# Altium schematic sheet SPI_Devices.SchDoc
size A4; SheetNumber: 7; SheetTotal: 11
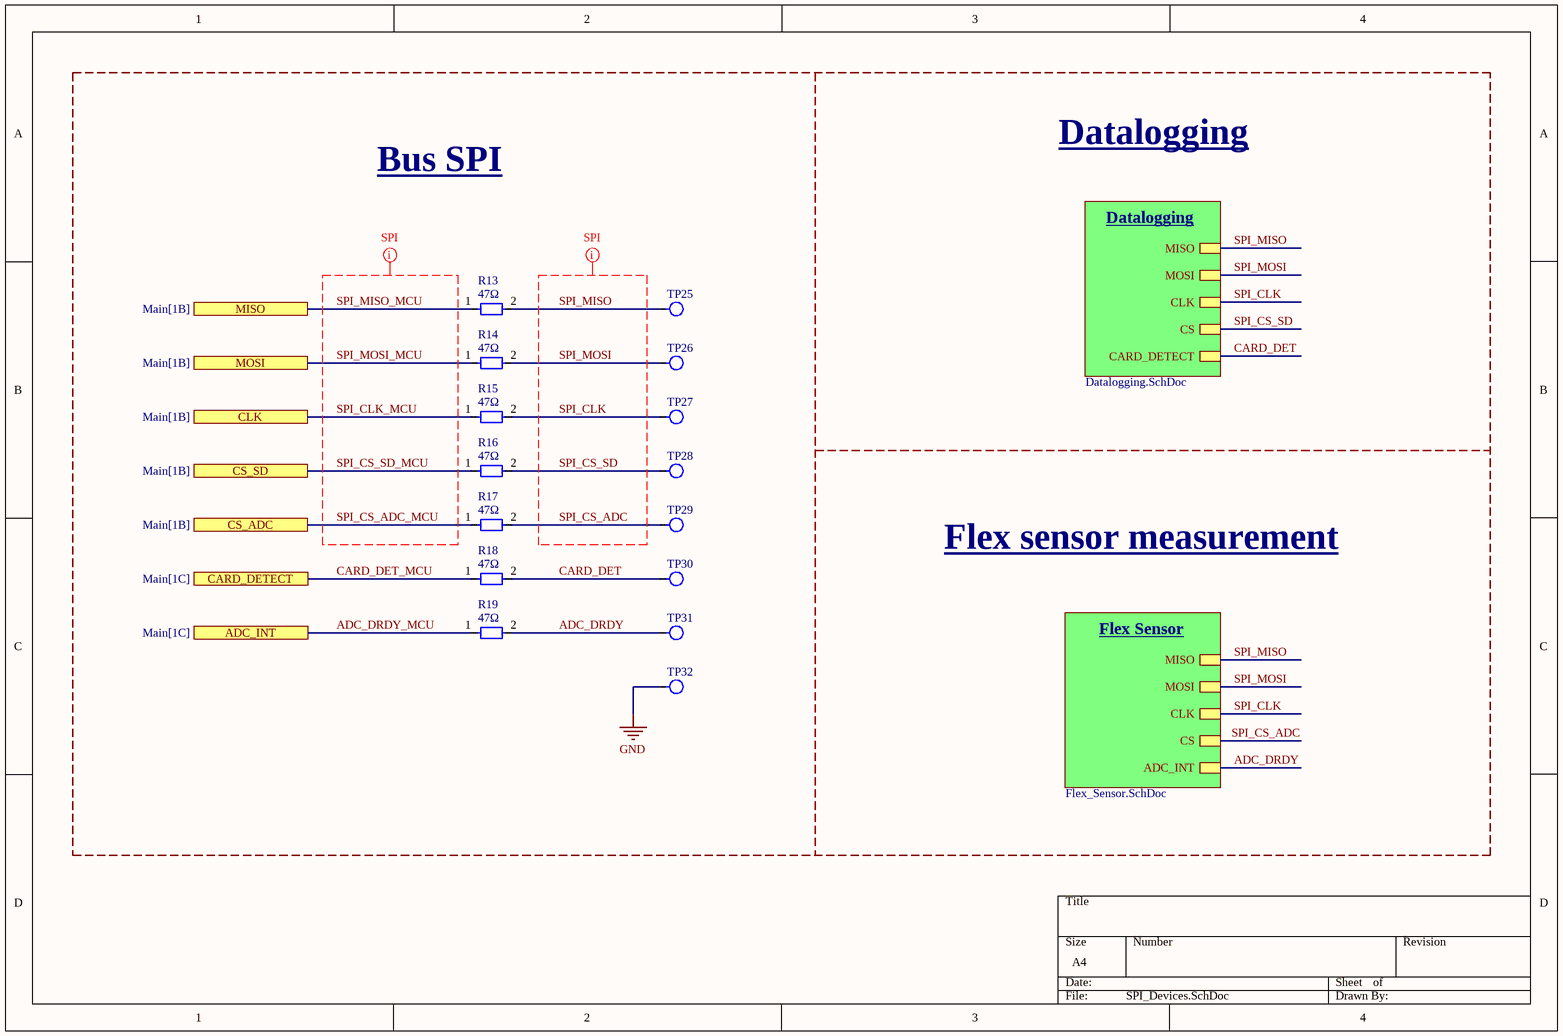
[diagram p0: SPI_Devices.SchDoc]

## Parts
R13  value 47Ω  [RES_0603]  (hidden comment: 47R)
R14  value 47Ω  [RES_0603]  (hidden comment: 47R)
R15  value 47Ω  [RES_0603]  (hidden comment: 47R)
R16  value 47Ω  [RES_0603]  (hidden comment: 47R)
R17  value 47Ω  [RES_0603]  (hidden comment: 47R)
R18  value 47Ω  [RES_0603]  (hidden comment: 47R)
R19  value 47Ω  [RES_0603]  (hidden comment: 47R)
TP25  Testpoint SMD  [Testpoint_SMD]  (value not drawn)  (no BOM)
TP26  Testpoint SMD  [Testpoint_SMD]  (value not drawn)  (no BOM)
TP27  Testpoint SMD  [Testpoint_SMD]  (value not drawn)  (no BOM)
TP28  Testpoint SMD  [Testpoint_SMD]  (value not drawn)  (no BOM)
TP29  Testpoint SMD  [Testpoint_SMD]  (value not drawn)  (no BOM)
TP30  Testpoint SMD  [Testpoint_SMD]  (value not drawn)  (no BOM)
TP31  Testpoint SMD  [Testpoint_SMD]  (value not drawn)  (no BOM)
TP32  Testpoint SMD  [Testpoint_SMD]  (value not drawn)  (no BOM)

## Sub-sheets
Datalogging = Datalogging.SchDoc: MISO, MOSI, CLK, CS, CARD_DETECT  | Titulo: Datalogging
Flex_Sensor = Flex_Sensor.SchDoc: MISO, MOSI, CLK, CS, ADC_INT  | Titulo: Flex Sensor

## Ports
ADC_INT (see Main[1C]), CARD_DETECT (see Main[1C]), CLK (see Main[1B]), CS_ADC (see Main[1B]), CS_SD (see Main[1B]), MISO (see Main[1B]), MOSI (see Main[1B])

## Nets
GND: TP32.1
ADC_DRDY: R19.2 TP31.1 ; sheet Flex_Sensor/ADC_INT
ADC_DRDY_MCU: R19.1 ; port ADC_INT
CARD_DET: R18.2 TP30.1 ; sheet Datalogging/CARD_DETECT
CARD_DET_MCU: R18.1 ; port CARD_DETECT
SPI_CLK: R15.2 TP27.1 ; sheet Datalogging/CLK, sheet Flex_Sensor/CLK
SPI_CLK_MCU: R15.1 ; port CLK
SPI_CS_ADC: R17.2 TP29.1 ; sheet Flex_Sensor/CS
SPI_CS_ADC_MCU: R17.1 ; port CS_ADC
SPI_CS_SD: R16.2 TP28.1 ; sheet Datalogging/CS
SPI_CS_SD_MCU: R16.1 ; port CS_SD
SPI_MISO: R13.2 TP25.1 ; sheet Datalogging/MISO, sheet Flex_Sensor/MISO
SPI_MISO_MCU: R13.1 ; port MISO
SPI_MOSI: R14.2 TP26.1 ; sheet Datalogging/MOSI, sheet Flex_Sensor/MOSI
SPI_MOSI_MCU: R14.1 ; port MOSI

## Layout directives
net class SPI: SPI_CLK, SPI_CLK_MCU, SPI_CS_ADC, SPI_CS_ADC_MCU, SPI_CS_SD, SPI_CS_SD_MCU, SPI_MISO, SPI_MISO_MCU, SPI_MOSI, SPI_MOSI_MCU

## Notes on the sheet
- Bus SPI
- Datalogging
- Flex sensor measurement

## Library data of the parts
R13-R19 = Generic R: RES  47R 1% 0603
TP25-TP32 = Testpoint_SMD: Testpoint SMD de 1mm de diametro.